# Altium schematic sheet 5_PDOC.SchDoc
size A4; SheetNumber: 5; SheetTotal: 7
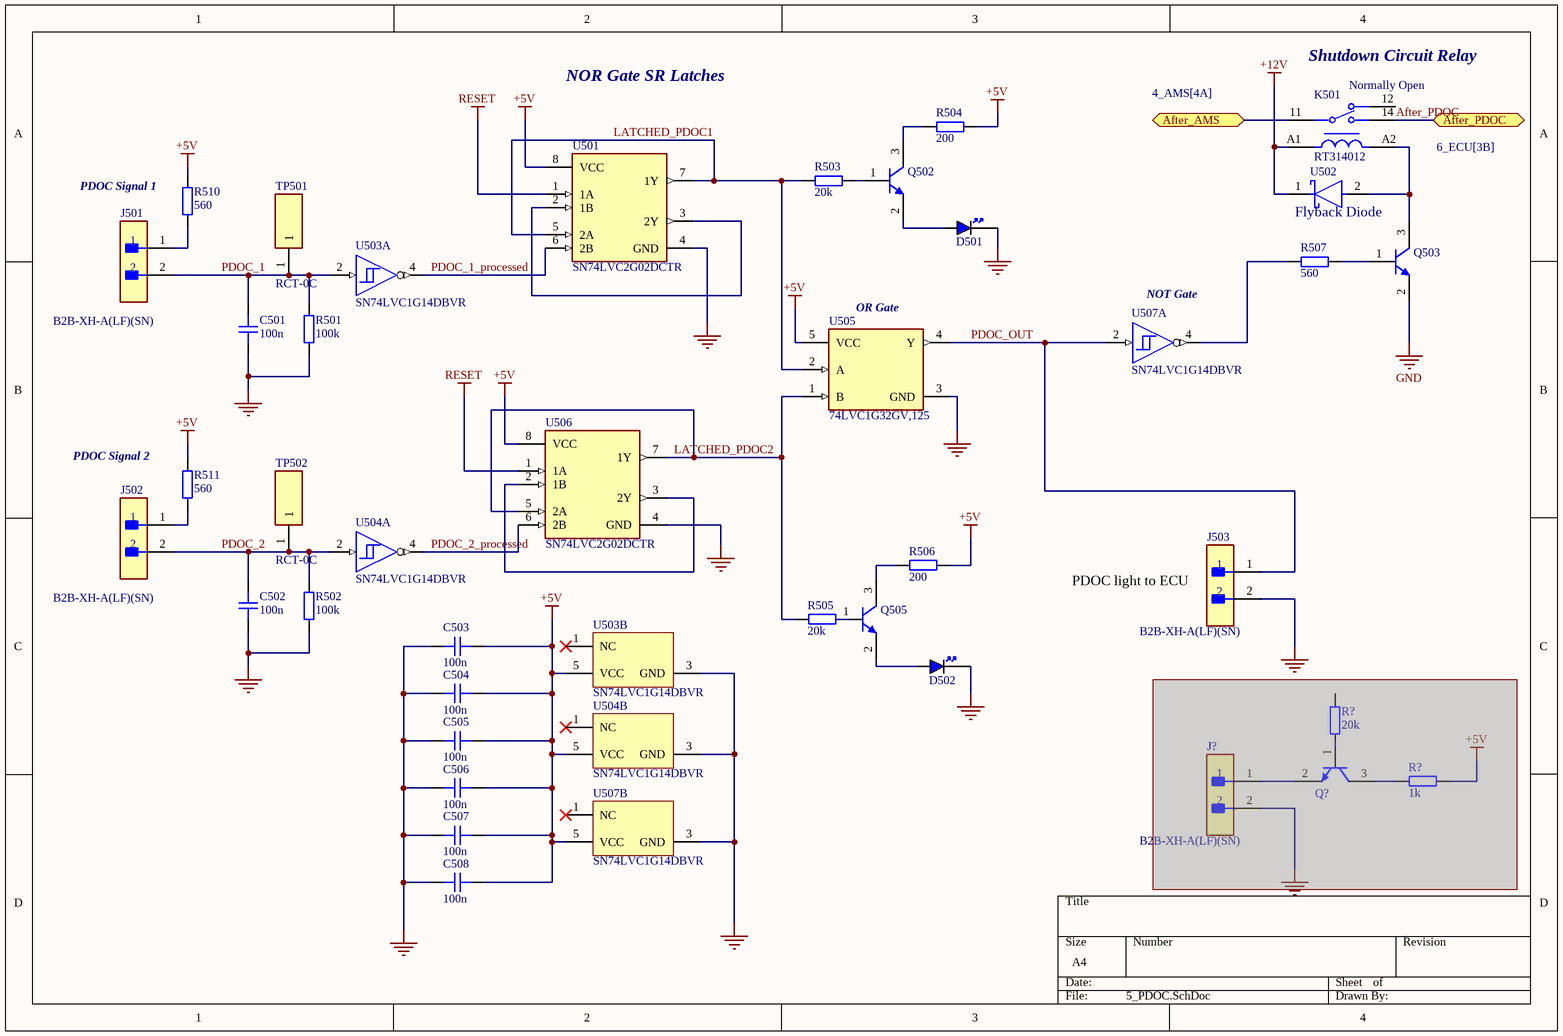
[diagram p0: 5_PDOC.SchDoc]

## Parts
(Parts that share a designator on the sheet are numbered #1, #2 ... from top to bottom, then left to right.)
C501  100n  [CAP_0805]
C502  100n  [CAP_0805]
C503  100n  [CAP_0805]
C504  100n  [CAP_0805]
C505  100n  [CAP_0805]
C506  100n  [CAP_0805]
C507  100n  [CAP_0805]
C508  100n  [CAP_0805]
D501  BLUE  [LED_0805_BLUE]  (value not drawn)
D502  BLUE  [LED_0805_BLUE]  (value not drawn)
J501  B2B-XH-A(LF)(SN)  [FP-B2B-XH-A_LF_SN-MFG]
J502  B2B-XH-A(LF)(SN)  [FP-B2B-XH-A_LF_SN-MFG]
J503  B2B-XH-A(LF)(SN)  [FP-B2B-XH-A_LF_SN-MFG]
J?  B2B-XH-A(LF)(SN)  [FP-B2B-XH-A_LF_SN-MFG]  (masked out: inside a compile mask, not in the netlist)
K501  RT314012  [FP-RT314012-MFG]
Q502  MMBT5550LT1G  [ONSC-SOT-23-3-318-08_V]  (value not drawn)
Q503  MMBT5550LT1G  [ONSC-SOT-23-3-318-08_V]  (value not drawn)
Q505  MMBT5550LT1G  [ONSC-SOT-23-3-318-08_V]  (value not drawn)
Q?  MMBT5550LT1G  [ONSC-SOT-23-3-318-08_V]  (value not drawn)  (masked out: inside a compile mask, not in the netlist)
R501  100k  [RES_0805]
R502  100k  [RES_0805]
R503  20k  [RES_0805]
R504  200  [RES_0805]
R505  20k  [RES_0805]
R506  200  [RES_0805]
R507  560  [RES_0805]
R510  560  [RES_0805]
R511  560  [RES_0805]
R?#1  20k  [RES_0805]  (masked out: inside a compile mask, not in the netlist)
R?#2  1k  [RES_0805]  (masked out: inside a compile mask, not in the netlist)
TP501  RCT-0C  [RCT-0C]
TP502  RCT-0C  [RCT-0C]
U501  SN74LVC2G02DCTR  [FP-DCT0008A-IPC_A]
U502  BAT54JFILM  [FP-SOD323-MFG]  (value not drawn)
U503  SN74LVC1G14DBVR  [DBV0005A_L]  (parts A,B of 2)
U504  SN74LVC1G14DBVR  [DBV0005A_L]  (parts A,B of 2)
U505  74LVC1G32GV,125  [FP-SOT753-MFG]
U506  SN74LVC2G02DCTR  [FP-DCT0008A-IPC_A]
U507  SN74LVC1G14DBVR  [DBV0005A_L]  (parts A,B of 2)

## Ports
After_AMS (bidir, see 4_AMS[4A]), After_PDOC (bidir, see 6_ECU[3B])

## Nets
+5V: C503.2 C504.2 C505.2 C506.2 C507.2 C508.2 R504.2 R506.2 R510.2 R511.2 U501.8(VCC) U503.5(VCC) U504.5(VCC) U505.5(VCC) U506.8(VCC) U507.5(VCC)
+12V: K501.A1 U502.1(C)
GND: C501.1 C502.1 C503.1 C504.1 C505.1 C506.1 C507.1 C508.1 D501.K D502.K J503.2 Q503.2(E) R501.1 R502.1 U501.4(GND) U503.3(GND) U504.3(GND) U505.3(GND) U506.4(GND) U507.3(GND)
RESET: U501.1(1A) U506.1(1A)
After_AMS: K501.11 ; port After_AMS
After_PDOC: K501.14 ; port After_PDOC
LATCHED_PDOC1: R503.2 U501.5(2A) U501.7(1Y) U505.2(A)
LATCHED_PDOC2: R505.2 U505.1(B) U506.5(2A) U506.7(1Y)
PDOC_1: C501.2 J501.2 R501.2 TP501.1 U503.2(A)
PDOC_1_processed: U501.6(2B) U503.4(Y)
PDOC_2: C502.2 J502.2 R502.2 TP502.1 U504.2(A)
PDOC_2_processed: U504.4(Y) U506.6(2B)
PDOC_OUT: J503.1 U505.4(Y) U507.2(A)
NetD501_A: D501.A Q502.2(E)
NetD502_A: D502.A Q505.2(E)
NetJ501_1: J501.1 R510.1
NetJ502_1: J502.1 R511.1
NetK501_A2: K501.A2 Q503.3(C) U502.2(A)
NetQ502_1: Q502.1(B) R503.1
NetQ502_3: Q502.3(C) R504.1
NetQ503_1: Q503.1(B) R507.2
NetQ505_1: Q505.1(B) R505.1
NetQ505_3: Q505.3(C) R506.1
NetR507_1: R507.1 U507.4(Y)
NetU501_2: U501.2(1B) U501.3(2Y)
NetU506_2: U506.2(1B) U506.3(2Y)

Not connected (* = marked no-connect by the designer): K501 12; U503 1(NC)*; U504 1(NC)*; U507 1(NC)*

## Notes on the sheet
- NOR Gate SR Latches
- (near K501) Shutdown Circuit Relay
- (near K501) Normally Open
- (near R510) PDOC Signal 1
- (near U502) Flyback Diode
- (near U505) OR Gate
- (near U507) NOT Gate
- (near R511) PDOC Signal 2
- (near J503) PDOC light to ECU

## Library data of the parts
C501-C508 = CAP_0805: Capacitor SMD 0805; Manufacturer: *; Manufacturer Part Number: *; Distributor Link: *; LCSC: *; Rating: *; Dielectric: *
D501 D502 = LED_0805_BLUE: LED 0805 BLUE SMD; Manufacturer: *; Manufacturer Part Number: *; Distributor Link: *; LCSC: *
J501-J503 J? = CMP-2000-05888-3: CONN HEADER VERT 2POS 2.5MM; Current Rating: 3A; Voltage Rating: 250V; Number of Contacts: 2; Contact Resistance: 20mR; Wire/Cable Gauge: 22AWG; Insulation Resistance: 1GR; Connector Type: Male Pin; Packaging: Bulk; Contact Material: Brass; Lead Free: Lead Free; Orientation: Straight; Contact Plating: Tin; Max Current Rating: 3A; Termination: Solder; Fastening Type: Detent; Depth: 5.75mm; Housing Material: Polyamide; REACH SVHC: No SVHC; Series: XH; Voltage Rating (AC): 250V; Number of Positions: 2; Color: Natural; Contact Type: Male Pin; Max Voltage Rating (DC): 250V; Pitch: 2.5mm; Lead Pitch: 2.5mm; Mount: Through Hole; Max Operating Temperature: 85°C; Length: 7.4mm; Max Voltage Rating (AC): 250V; Min Operating Temperature: -25°C; Number of Rows: 1; Housing Color: White
K501 = CMP-03395-000105-1: RELAY GEN PURPOSE SPDT 16A 12V; Manufacturer: TE Connectivity; Coil Type: Non-Latching; Number Of Contacts: 1; Coil Power: 400mW; Coil Resistance: 360Ω; Device Class L2: Relays; Digikey Description: RELAY GEN PURPOSE SPDT 16A 12V; Coil Voltage: 12V; RoHS: TRUE; Category: Relay; Lead Free: Yes; Manufacturer Part Number: RT314012; ComponentLink2Description: Datasheet; Throw Configuration: SPDT; Current Rating: 16A; Ambient Temperature Range Low: -40°C; ComponentLink2URL: https://www.te.com/commerce/DocumentDelivery/DDEController?Action=showdoc&DocId=Data+Sheet%7FRT1%7F0219%7Fpdf%7FEnglish%7FENG_DS_RT1_0219.pdf%7F9-1393239-5; Automotive: No; Device Class L1: Electromechanical; Octopart: https://octopart.com/9-1393239-5-te+connectivity-46509288; Ambient Temperature Range High: +85°C; Height: 15.7mm; Package: RT314012; Device Class L3: Power Relays
Q502 Q503 Q505 Q? = CMP-1048-00659-1: High Voltage Transistor, NPN Silicon, 3-Pin SOT-23, Pb-Free, Tape and Reel; Manufacturer: On Semiconductor; IC Continuous (A): 0.6; PackageDescription: 3-Pin Small Outline Transistor, Body 2.92 x 1.3 mm, Pitch 0.95 mm; ComponentLink3URL: http://www.onsemi.cn/pub_link/Collateral/318-08.PDF; RoHS: TRUE; ComponentLink2URL: http://www.onsemi.cn/pub_link/Collateral/MMBT5550LT1-D.PDF; DatasheetVersion: Rev. 10; ComponentLink1URL: http://www.onsemi.com/; PackageReference: SOT-23-3-318-08; PackageVersion: Rev. AP, 11/2009; Mounting Technology: Surface Mount; ComponentLink2Description: Datasheet; PartNumber: MMBT5550LT1G; ComponentLink3Description: Package Specification; Packing: Tape and Reel; Polarity: NPN; ComponentLink1Description: Manufacturer URL
R501-R507 R510 R511 R?#1 R?#2 = RES_0805: Resistor SMD 0805; Manufacturer: *; Manufacturer Part Number: *; Distributor Link: *; LCSC: *
TP501 TP502 = RCT-0C: Test Point; Manufacturer_Name: TE Connectivity; Datasheet Link: https://www.te.com/commerce/DocumentDelivery/DDEController?Action=srchrtrv&DocNm=1773266&DocType=Data%20Sheet&DocLang=English&PartCntxt=1625854-2&DocFormat=pdf; Manufacturer_Part_Number: RCT-0C; Mouser Part Number: 279-RCT-0C; Mouser Price/Stock: https://www.mouser.co.uk/ProductDetail/TE-Connectivity-Holsworthy/RCT-0C?qs=ip69W3eHERWzZOsRKmFYAw%3D%3D; Arrow Part Number: RCT-0C; Arrow Price/Stock: https://www.arrow.com/en/products/rct-0c/te-connectivity?region=nac
U501 U506 = CMP-0859-00563-4: IC GATE NOR 2CH 2-INP SM8; Number of Outputs: 1; High Level Output Current: -32mA; Number of Bits: 2; Max Supply Voltage: 5.5V; Turn-On Delay Time: 4.4ns; Min Supply Voltage: 1.65V; Low Level Output Current: 32mA; Operating Supply Voltage: 3.3V; Quiescent Current: 10uA; Logic Function: NOR GATE; Max Operating Temperature: 125°C; Radiation Hardening: No; Number of Pins: 8; Lead Free: Lead Free; Packaging: Tape and Reel; Number of Gates: 2; Package Quantity: 1; Number of Elements: 2; REACH SVHC: No SVHC; Max Output Current: 32mA; Propagation Delay: 4.4ns; Termination: SMD/SMT; Number of Inputs: 2; Mount: Surface Mount; Output Current: 32mA; Case/Package: SSOP; Min Operating Temperature: -40°C; Weight: 0.000825oz; Number of Circuits: 2; Number of Output Lines: 1; RoHS Compliant: Yes; Number of Input Lines: 2
U502 = CMP-2000-05927-2: DIODE SCHOTTKY 40V 300MA SOD323; Manufacturer: STMicroelectronics; Max Surge Forward Current: 1.25A; Value: 7pF; Max Junction Temp: +150°C; Peak Reverse Current: 1uA; Standoff Height: 0mm; ComponentLink2Description: Datasheet; Device Class L2: Diodes; Mouser Description: Schottky Diodes & Rectifiers 300mA 40 Volt; Forward Current: 300mA; Temperature Range Low: -40°C; Temperature Range High: +150°C; Digikey Description: DIODE SCHOTTKY 40V 300MA SOD323; Capacitance: 7pF; Ipc Land Pattern Name: SOD250128X117-2; Automotive: No; Manufacturer Part Number: BAT54JFILM; Device Class L1: Discrete Semiconductors; Lead Free: Yes; ComponentLink2URL: https://www.st.com/resource/en/datasheet/bat54.pdf; Package: SOD323; Temperature: -40°C to +150°C; Category: IC; Height: 1.17mm; Octopart: https://octopart.com/bat54jfilm-stmicroelectronics-326073; RoHS: TRUE; Device Class L3: Schottky Diodes; Max Repetitive Reverse Voltage: 40V
U503 U504 U507 = CMP-0859-00030-4: Single Schmitt-Trigger Inverter, DBV0005A, LARGE T&R; Manufacturer: Texas Instruments; Input Type: CMOS/TTL; Output Drive (IOL/IOH)(Max)(mA): 32/-32; VCC(Min)(V): 1.65; 3-State Output: No; Schmitt Trigger: Yes; tpd @ Nom Voltage(Max)(ns): 11,6.5,5.5,5; VCC(Max)(V): 5.5; Output Type: CMOS; Bits(#): 1; Voltage(Nom)(V): 1.8,2.5,3.3,5; Sub-Family: Inverting Buffer/Driver; Logic: Inverting; Technology Family: LVC; F @ Nom Voltage(Max)(Mhz): 150; Rating: Catalog; ICC @ Nom Voltage(Max)(mA): 0.01; DatasheetVersion: SCES218W; PackageReference: DBV0005A; Generic Part Number: SN74LVC1G14; Operating Temperature Range(C): -40 to 125,-40 to 85
U505 = CMP-14350-000001-1: IC GATE OR 1CH 2-INP 5TSOP; Manufacturer: Nexperia; Frequency: 150MHz; Number Of Outputs: 1; Max Supply Voltage: 5.5V; Propagation Delay: 1.7ns; Number Of Inputs: 2; Min Supply Voltage: 1.65V; Standoff Height: 0.013mm; Manufacturer Part Number: 74LVC1G32GV,125; Height: 1.1mm; Category: IC; Logic Function Desc: OR; Digikey Description: IC GATE OR 1CH 2-INP 5TSOP; Package: SOT753; Octopart: https://octopart.com/74lvc1g32gv%2C125-nexperia-78737904; Ambient Temperature Range Low: -40°C; Device Class L2: Logic ICs; Temperature: -40°C to +125°C; Ipc Land Pattern Name: SOT95P275X100-5; ComponentLink2Description: Datasheet; Device Class L1: Integrated Circuits (ICs); Footprint Url: https://assets.nexperia.com/documents/outline-drawing/SOT753.pdf; Number Of Circuits: 1; Device Class L3: Logic Gates; ComponentLink2URL: https://assets.nexperia.com/documents/data-sheet/74LVC1G32.pdf; Temperature Range Low: -40°C; Automotive: No; RoHS: TRUE; Lead Free: Yes; Ambient Temperature Range High: +125°C; Temperature Range High: +125°C